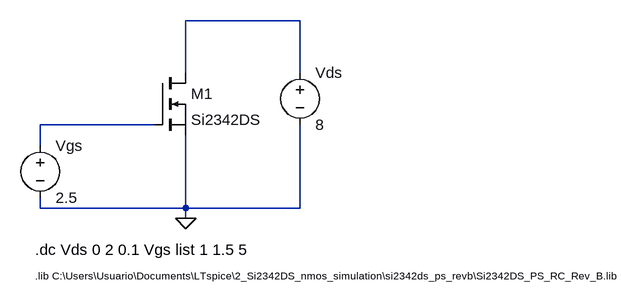
[diagram p0: schematic Si2342DS.asc]
Si2342DS.asc, the LTspice schematic file:
Version 4.1
SHEET 1 1340 680
WIRE 368 32 192 32
WIRE 192 112 192 32
WIRE 368 112 368 32
WIRE 144 192 -32 192
WIRE -32 224 -32 192
WIRE -32 320 -32 304
WIRE 192 320 192 208
WIRE 192 320 -32 320
WIRE 368 320 368 192
WIRE 368 320 192 320
WIRE 192 336 192 320
FLAG 192 336 0
SYMBOL nmos 144 112 R0
SYMATTR InstName M1
SYMATTR Value Si2342DS
SYMATTR Prefix X
SYMBOL voltage -32 208 R0
WINDOW 123 0 0 Left 0
WINDOW 39 0 0 Left 0
SYMATTR InstName Vgs
SYMATTR Value 2.5
SYMBOL voltage 368 96 R0
WINDOW 123 0 0 Left 0
WINDOW 39 0 0 Left 0
SYMATTR InstName Vds
SYMATTR Value 8
TEXT -40 424 Left 1 !.lib C:\\Users\\Usuario\\Documents\\LTspice\\2_Si2342DS_nmos_simulation\\si2342ds_ps_revb\\Si2342DS_PS_RC_Rev_B.lib
TEXT -40 384 Left 2 !.dc Vds 0 2 0.1 Vgs list 1 1.5 5

The netlist it stands for:
* Si2342DS.asc
X§M1 N001 N002 0 Si2342DS  ; pins D G S
Vgs N002 0 2.5
Vds N001 0 8
.lib C:\Users\Usuario\Documents\LTspice\2_Si2342DS_nmos_simulation\si2342ds_ps_revb\Si2342DS_PS_RC_Rev_B.lib
.dc Vds 0 2 0.1 Vgs list 1 1.5 5
.backanno
.end